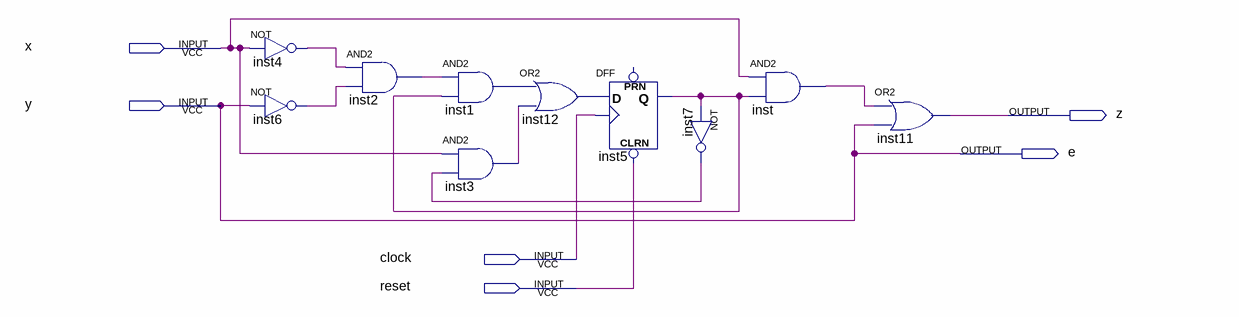
[diagram p0: schematic sheet]
// Quartus schematic vending.bdf as structural Verilog: 10 symbols, 6 pins
module vending (
  input  x,
  input  y,
  input  clock,
  input  reset,
  output z,
  output e
);

  wire inst1_out, inst2_out, inst3_out, inst4_out, inst5_q, inst6_out, inst7_out, inst12_out, inst_out;

  not inst4 (inst4_out, x);
  not inst6 (inst6_out, y);
  and inst2 (inst2_out, inst4_out, inst6_out);
  and inst1 (inst1_out, inst2_out, inst5_q);
  and inst3 (inst3_out, x, inst7_out);
  or inst12 (inst12_out, inst1_out, inst3_out);
  DFF inst5 (.CLRN(reset), .CLK(clock), .D(inst12_out), .Q(inst5_q));  // open: PRN
  not inst7 (inst7_out, inst5_q);
  and inst (inst_out, x, inst5_q);
  or inst11 (z, inst_out, y);

  assign e = y;
endmodule
